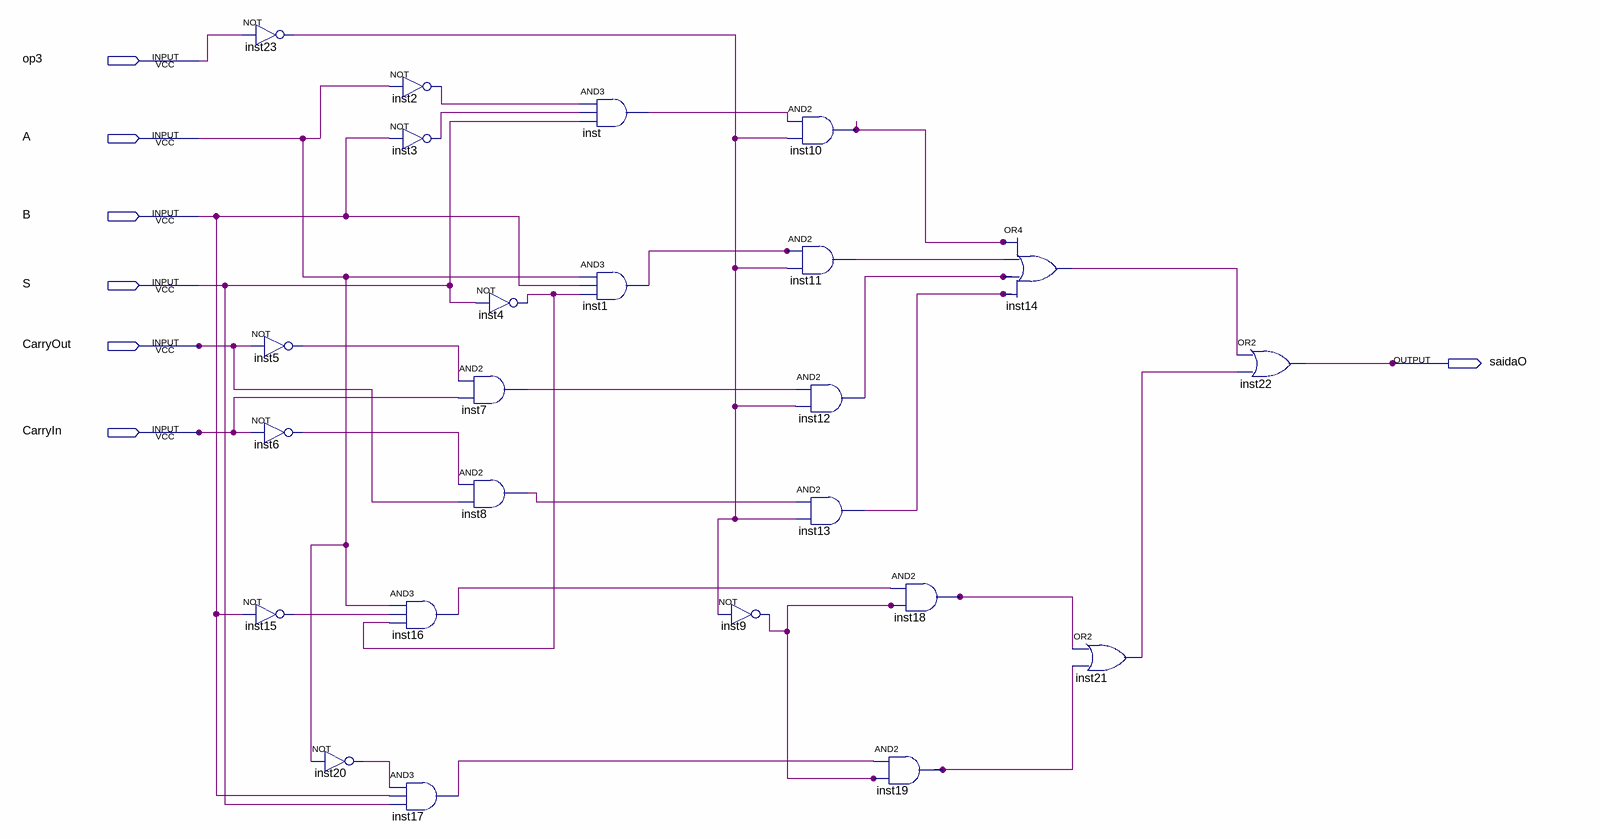
[diagram p0: schematic sheet]
// Quartus schematic detecta_overflow.bdf as structural Verilog: 24 symbols, 7 pins
module detecta_overflow (
  input  op3,
  input  A,
  input  B,
  input  S,
  input  CarryOut,
  input  CarryIn,
  output saidaO
);

  wire inst1_out, inst2_out, inst3_out, inst4_out, inst5_out, inst6_out, inst7_out, inst8_out, inst9_out,
       inst10_out, inst11_out, inst12_out, inst13_out, inst14_out, inst15_out, inst16_out, inst17_out,
       inst18_out, inst19_out, inst20_out, inst21_out, inst23_out, inst_out;

  not inst23 (inst23_out, op3);
  not inst15 (inst15_out, B);
  not inst5 (inst5_out, CarryOut);
  not inst6 (inst6_out, CarryIn);
  not inst20 (inst20_out, A);
  not inst2 (inst2_out, A);
  not inst3 (inst3_out, B);
  and inst16 (inst16_out, A, inst15_out, inst4_out);
  and inst17 (inst17_out, inst20_out, B, S);
  not inst4 (inst4_out, S);
  and inst7 (inst7_out, inst5_out, CarryIn);
  and inst8 (inst8_out, inst6_out, CarryOut);
  and inst (inst_out, inst2_out, inst3_out, S);
  and inst1 (inst1_out, A, B, inst4_out);
  not inst9 (inst9_out, inst23_out);
  and inst10 (inst10_out, inst_out, inst23_out);
  and inst11 (inst11_out, inst1_out, inst23_out);
  and inst12 (inst12_out, inst7_out, inst23_out);
  and inst13 (inst13_out, inst8_out, inst23_out);
  and inst18 (inst18_out, inst16_out, inst9_out);
  and inst19 (inst19_out, inst17_out, inst9_out);
  or inst14 (inst14_out, inst10_out, inst11_out, inst12_out, inst13_out);
  or inst21 (inst21_out, inst18_out, inst19_out);
  or inst22 (saidaO, inst14_out, inst21_out);
endmodule
